# Altium schematic sheet VC_Peripherals.SchDoc: On-Board Peripherals
size A4; SheetNumber: 3; SheetTotal: 4; FileInfo: VC_Peripherals.SchDoc
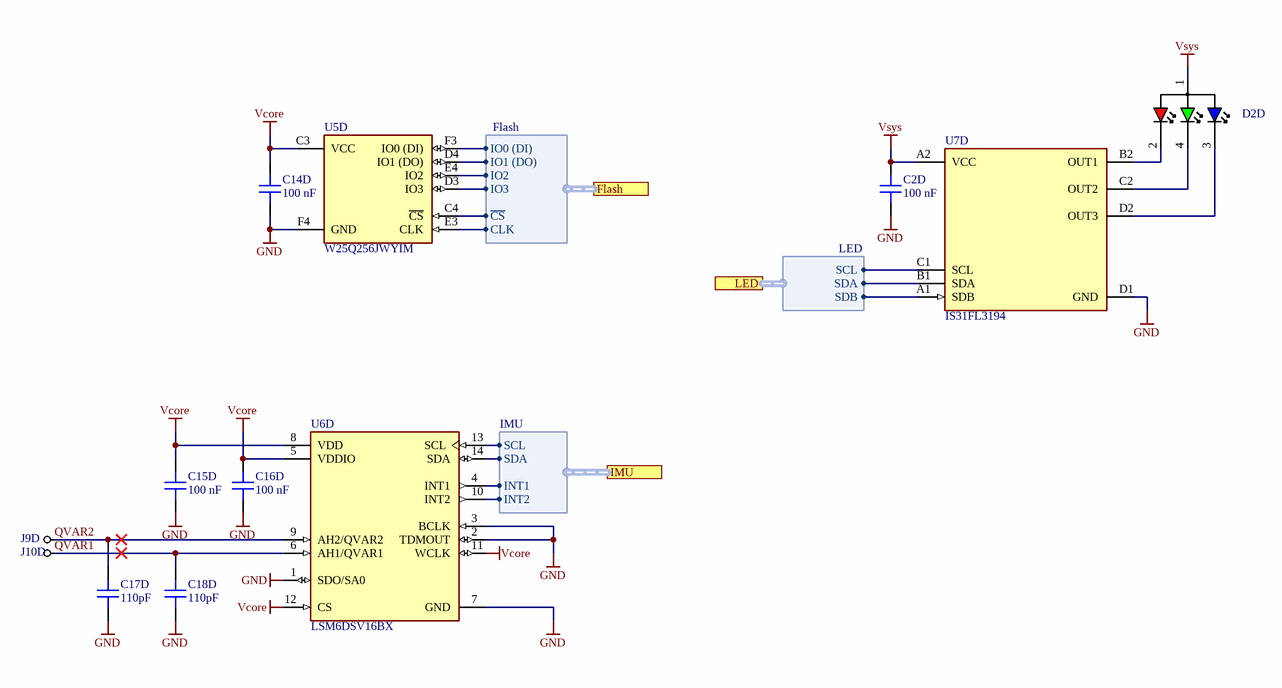
[diagram p0: VC_Peripherals.SchDoc]

## Parts
C2D  100 nF  [CAP_0201]
C14D  100 nF  [CAP_0201]
C15D  100 nF  [CAP_0201]
C16D  100 nF  [CAP_0201]
C17D  110pF  [CAP_0201]
C18D  110pF  [CAP_0201]
D2D  SML-LX0404SIUPGUSB  [SML-LX0404SIUPGUSB]  (value not drawn)
J9D  PADSMD  [PADSMD_ROUND]  (value not drawn)  (no BOM)
J10D  PADSMD  [PADSMD_ROUND]  (value not drawn)  (no BOM)
U5D  W25Q256JWYIM  [WLCSP_32_W25Q256JWYIM]
U6D  LSM6DSV16BX  [LGA-14_STM]
U7D  IS31FL3194  [WLCSP_8_P0.4]

## Ports
Flash (harness Flash), IMU (harness IMU), LED (harness LED)

## Harnesses
Flash: IO0 (DI), IO1 (DO), IO2, IO3, ~{CS}, CLK
IMU: SCL, SDA, INT1, INT2
LED: SCL, SDA, SDB

## Nets
GND: C2D.1 C14D.1 C15D.1 C16D.1 C17D.1 C18D.1 U5D.F4(GND) U6D.1(SDO/SA0) U6D.2(TDMOUT) U6D.3(BCLK) U6D.7(GND) U7D.D1(GND)
Vcore: C14D.2 C15D.2 C16D.2 U5D.C3(VCC) U6D.5(VDDIO) U6D.8(VDD) U6D.11(WCLK) U6D.12(CS)
Vsys: C2D.2 D2D.1(Common_Anode) U7D.A2(VCC)
QVAR1: C18D.2 J10D.0 U6D.6(AH1/QVAR1)
QVAR2: C17D.2 J9D.0 U6D.9(AH2/QVAR2)
NetD2D_2: D2D.2(Red_C) U7D.B2(OUT1)
NetD2D_3: D2D.3(Blue_C) U7D.D2(OUT3)
NetD2D_4: D2D.4(Green_C) U7D.C2(OUT2)
NetU5D_C4: U5D.C4(~{CS}) ; port Flash.~{CS}
NetU5D_D3: U5D.D3(IO3) ; port Flash.IO3
NetU5D_D4: U5D.D4(IO1_(DO)) ; port Flash.IO1 (DO)
NetU5D_E3: U5D.E3(CLK) ; port Flash.CLK
NetU5D_E4: U5D.E4(IO2) ; port Flash.IO2
NetU5D_F3: U5D.F3(IO0_(DI)) ; port Flash.IO0 (DI)
NetU6D_4: U6D.4(INT1) ; port IMU.INT1
NetU6D_10: U6D.10(INT2) ; port IMU.INT2
NetU6D_13: U6D.13(SCL) ; port IMU.SCL
NetU6D_14: U6D.14(SDA) ; port IMU.SDA
NetU7D_A1: U7D.A1(SDB) ; port LED.SDB
NetU7D_B1: U7D.B1(SDA) ; port LED.SDA
NetU7D_C1: U7D.C1(SCL) ; port LED.SCL

## Notes on the sheet
- Project:
- Laboratory:
- Date:
- File:
- Rev:
- Variant:
- License:
- Drawn By:
- Checked By:
- Sheet:
- /

## Library data of the parts
C2D C14D C15D C16D = CAP_0201_100n_10V: CAP CER 0.1UF 10V X5R 0201; Manufacturer: Murata; Manufacturer Part Number: GRM033Z71A104KE14D; Supplier 1: Mouser; Supplier Part Number 1: 81-GRM033Z71A104KE4D
C17D C18D = CAP_0201_110p_50V: CAP CER 110PF 50V C0G 0201; Manufacturer: Murata; Manufacturer Part Number: GRM0335C1H111JA01D; Supplier 1: Mouser; Supplier Part Number 1: 81-GRM0335C1H111JA1D
D2D = D_RGB_LED: SML-LX0404SIUPGUSB RGB LED; Manufacturer: Lumex; Supplier 1: Mouser; Manufacturer Part Number: SML-LX0404SIUPGUSB; Supplier Part Number 1: 696-LX0404SIUPGUSB
J9D J10D = PADSMD: SMD Pad
U5D = W25Q256JWYIM: NOR-Flash spiFlash, 1.8V, 256M-bit, 4Kb Uniform Sector, DTR; Manufacturer Part Number: W25Q256JWYIM TR; Manufacturer: Winbond; Supplier 1: Mouser; Supplier Part Number 1: 454-W25Q256JWYIMTR
U6D = LSM6DSV16BX: IMU ACCEL/GYRO I2C/SPI 14LGA; Manufacturer: STMicroelectronics; Manufacturer Part Number: LSM6DSV16BX; Supplier 1: Mouser; Supplier Part Number 1: 511-LSM6DSV16BXTR
U7D = IS31FL3194: LED Driver with Programmable Pattern Sequencing 3-Channel 40mA 8-Pin WCSP T/R; Manufacturer: ISSI; Manufacturer Part Number: IS31FL3194-CLS2-TR; Supplier 1: Digi-Key; Supplier Part Number 1: 2521-IS31FL3194-CLS2-TRCT-ND